# Altium schematic sheet USB_fix.SchDoc
size A3; SheetNumber: 5; SheetTotal: 10
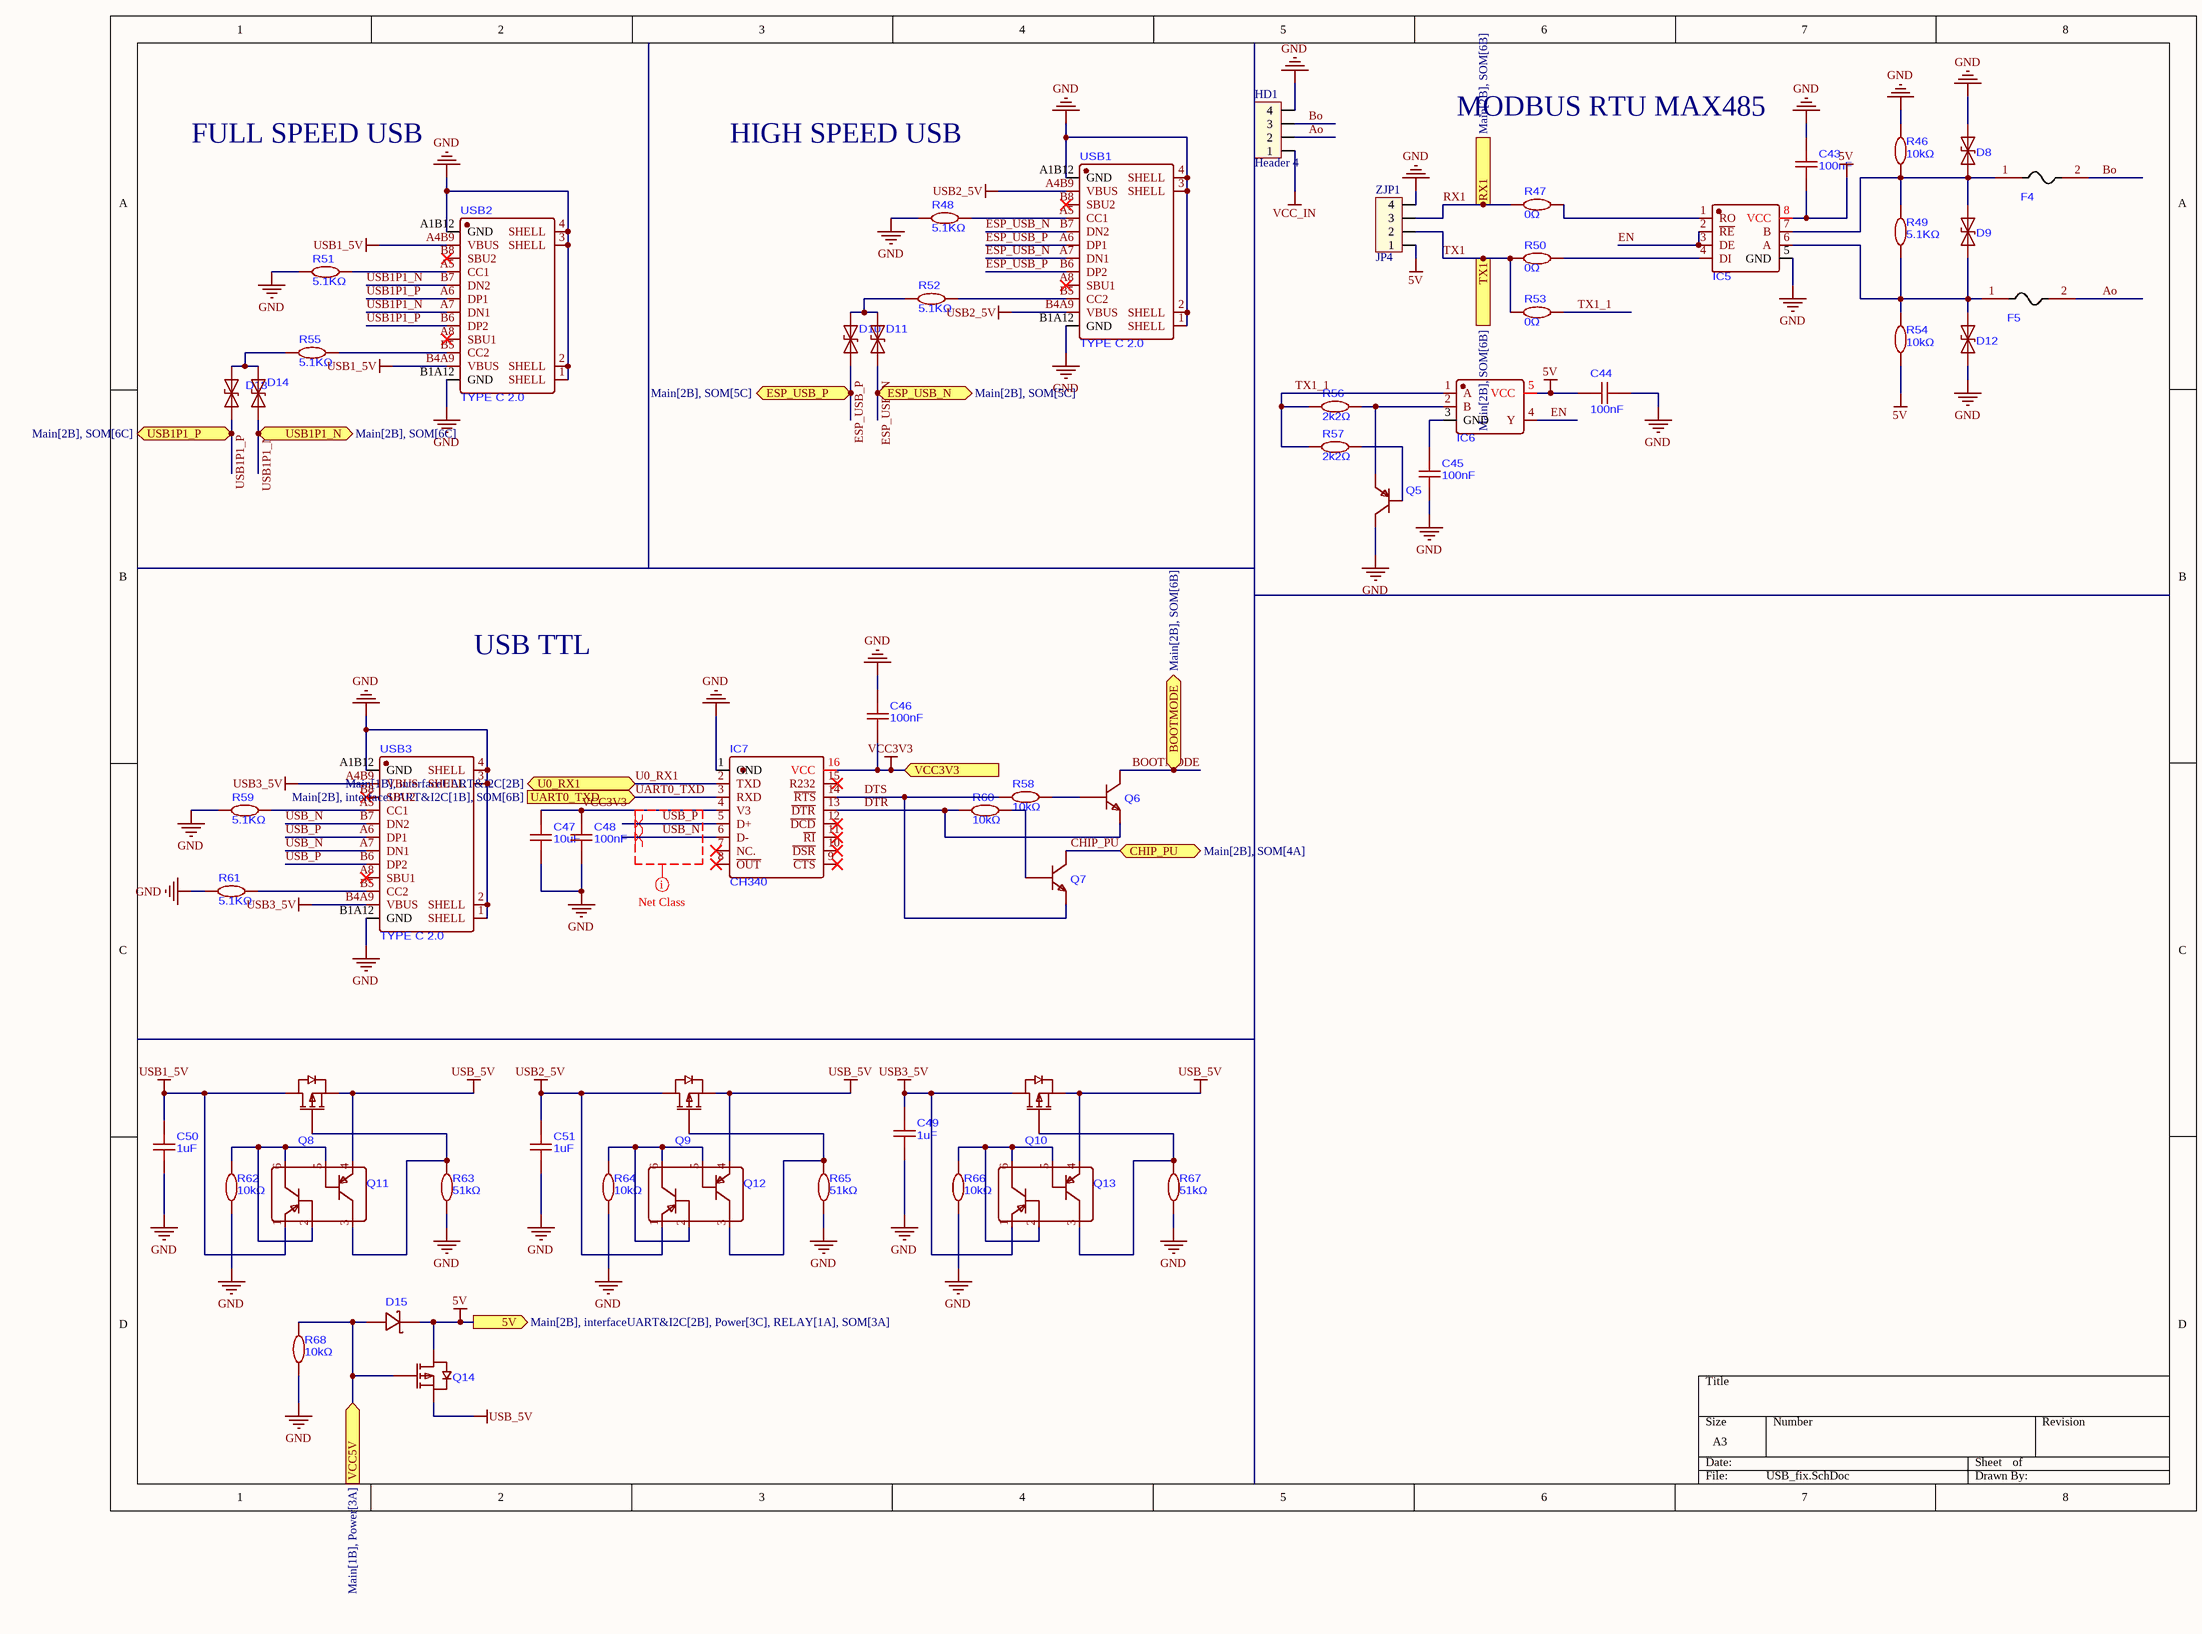
[diagram p0: USB_fix.SchDoc]

## Parts
C43  100nF  [C0603]
C44  100nF  [C0603]
C45  100nF  [C0603]
C46  100nF  [C0603]
C47  10uF  [C0603]
C48  100nF  [C0603]
C49  1uF  [C0603]
C50  1uF  [C0603]
C51  1uF  [C0603]
D8  TVS DIODE 5VWM 18.6VC SOD-523  [SOD-523_L1.2-W0.8-LS1.6-BI]  (value not drawn)
D9  TVS DIODE 5VWM 18.6VC SOD-523  [SOD-523_L1.2-W0.8-LS1.6-BI]  (value not drawn)
D10  TVS DIODE 5VWM 18.6VC SOD-523  [SOD-523_L1.2-W0.8-LS1.6-BI]  (value not drawn)
D11  TVS DIODE 5VWM 18.6VC SOD-523  [SOD-523_L1.2-W0.8-LS1.6-BI]  (value not drawn)
D12  TVS DIODE 5VWM 18.6VC SOD-523  [SOD-523_L1.2-W0.8-LS1.6-BI]  (value not drawn)
D13  TVS DIODE 5VWM 18.6VC SOD-523  [SOD-523_L1.2-W0.8-LS1.6-BI]  (value not drawn)
D14  TVS DIODE 5VWM 18.6VC SOD-523  [SOD-523_L1.2-W0.8-LS1.6-BI]  (value not drawn)
D15  B540CQ-13-F  [SMC_L6.9-W5.9-LS7.9-RD]  (value not drawn)
F4  PTC RESET FUSE 24V 100mA 0603  [F0603]  (value not drawn)
F5  PTC RESET FUSE 24V 100mA 0603  [F0603]  (value not drawn)
HD1  Header 4  [HED4]
IC5  Low-Power, Slew-Rate-Limited RS-485/RS-422 Transceivers  [SOP-8_L4.9-W3.9-P1.27-LS6.0-BL]  (value not drawn)
IC6  SINGLE 2-INPUT NAND GATE WITH SCHMITT-TRIGGER INPUTS  [SOT-23-5_L3.0-W1.7-P0.95-LS2.8-BL]  (value not drawn)
IC7  CH340  [SOP-16_L10.0-W3.9-P1.27-LS6.0-BL]
Q5  TRANS PNP 25V 1.5A SOT-23  [SOT-23-3_L2.9-W1.3-P1.90-LS2.4-BR]  (value not drawn)
Q6  TRANS NPN 25V 0.5A SOT-23  [SOT-23-3_L2.9-W1.3-P1.90-LS2.4-BR]  (value not drawn)
Q7  TRANS NPN 25V 0.5A SOT-23  [SOT-23-3_L2.9-W1.3-P1.90-LS2.4-BR]  (value not drawn)
Q8  MOSFET P-CH 30V 4.3A SOT-23  [SOT-23-3_L2.9-W1.6-P1.90-LS2.8-BR]  (value not drawn)
Q9  MOSFET P-CH 30V 4.3A SOT-23  [SOT-23-3_L2.9-W1.6-P1.90-LS2.8-BR]  (value not drawn)
Q10  MOSFET P-CH 30V 4.3A SOT-23  [SOT-23-3_L2.9-W1.6-P1.90-LS2.8-BR]  (value not drawn)
Q11  TRANS PNP 40V 200mA SOT-363  [SC-70-6_L2.2-W1.3-P0.65-LS2.1-TL]  (value not drawn)
Q12  TRANS PNP 40V 200mA SOT-363  [SC-70-6_L2.2-W1.3-P0.65-LS2.1-TL]  (value not drawn)
Q13  TRANS PNP 40V 200mA SOT-363  [SC-70-6_L2.2-W1.3-P0.65-LS2.1-TL]  (value not drawn)
Q14  MOSFET P-CH 30V 4.3A SOT-23  [SOT-23-3_L2.9-W1.6-P1.90-LS2.8-BR]  (value not drawn)
R46  10kΩ  [R0603]
R47  0Ω  [R0603]
R48  5.1KΩ  [R0603]
R49  5.1KΩ  [R0603]
R50  0Ω  [R0603]
R51  5.1KΩ  [R0603]
R52  5.1KΩ  [R0603]
R53  0Ω  [R0603]
R54  10kΩ  [R0603]
R55  5.1KΩ  [R0603]
R56  2k2Ω  [R0603]
R57  2k2Ω  [R0603]
R58  10kΩ  [R0603]
R59  5.1KΩ  [R0603]
R60  10kΩ  [R0603]
R61  5.1KΩ  [R0603]
R62  10kΩ  [R0603]
R63  51kΩ  [R0603]
R64  10kΩ  [R0603]
R65  51kΩ  [R0603]
R66  10kΩ  [R0603]
R67  51kΩ  [R0603]
R68  10kΩ  [R0603]
USB1  TYPE C 2.0  [USB-C-SMD_G-SWITCH_GT-USB-7010ASV]
USB2  TYPE C 2.0  [USB-C-SMD_G-SWITCH_GT-USB-7010ASV]
USB3  TYPE C 2.0  [USB-C-SMD_G-SWITCH_GT-USB-7010ASV]
ZJP1  JP4  [CON4]

## Ports
5V (out, see Main[2B], interfaceUART&I2C[2B], Power[3C], RELAY[1A], SOM[3A]), BOOTMODE (bidir, see Main[2B], SOM[6B]), CHIP_PU (bidir, see Main[2B], SOM[4A]), ESP_USB_N (bidir, see Main[2B], SOM[5C]), ESP_USB_P (bidir, see Main[2B], SOM[5C]), RX1 (out, see Main[2B], SOM[6B]), TX1 (in, see Main[2B], SOM[6B]), U0_RX1 (bidir, see Main[1B], interfaceUART&I2C[2B]), UART0_TXD (in, see Main[2B], interfaceUART&I2C[1B], SOM[6B]), USB1P1_N (bidir, see Main[2B], SOM[6C]), USB1P1_P (bidir, see Main[2B], SOM[6C]), VCC3V3 (in, see Main[1B], AUDIO CODEC[2C], Power[4C], SENSOR[3A], SOM[4A]), VCC5V (in, see Main[1B], Power[3A])

## Nets
5V: C43.1 C44.2 D15.1(C) IC5.8(VCC) IC6.5(VCC) Q14.3(D) R54.1 ZJP1.1 ; port 5V
GND: C43.2 C44.1 C45.1 C46.2 C47.1 C48.1 C49.1 C50.1 C51.1 D8.2(A) D12.1(K) HD1.4 IC5.5(GND) IC7.1(GND) Q5.3(C) R46.2 R48.1 R51.1 R59.1 R61.1 R62.1 R63.1 R64.1 R65.1 R66.1 R67.1 R68.1 USB1.1(SHELL) USB1.2(SHELL) USB1.3(SHELL) USB1.4(SHELL) USB1.A1B12(GND) USB1.B1A12(GND) USB2.1(SHELL) USB2.2(SHELL) USB2.3(SHELL) USB2.4(SHELL) USB2.A1B12(GND) USB2.B1A12(GND) USB3.1(SHELL) USB3.2(SHELL) USB3.3(SHELL) USB3.4(SHELL) USB3.A1B12(GND) USB3.B1A12(GND) ZJP1.4
USB1_5V: C50.2 Q8.3(D) Q11.1(E2) USB2.A4B9(VBUS) USB2.B4A9(VBUS)
USB2_5V: C51.2 Q9.3(D) Q12.1(E2) USB1.A4B9(VBUS) USB1.B4A9(VBUS)
USB3_5V: C49.2 Q10.3(D) Q13.1(E2) USB3.A4B9(VBUS) USB3.B4A9(VBUS)
USB_5V: Q8.2(S) Q9.2(S) Q10.2(S) Q11.4(E1) Q12.4(E1) Q13.4(E1) Q14.2(S)
VCC3V3: C46.1 C47.2 C48.2 IC7.4(V3) IC7.16(VCC) ; port VCC3V3
VCC_IN: HD1.1
Ao: F5.2 HD1.2
Bo: F4.2 HD1.3
BOOTMODE: Q6.3(C) ; port BOOTMODE
CHIP_PU: Q7.3(C) ; port CHIP_PU
DTR: IC7.13(~{DTR}) Q6.2(E) R60.1
DTS: IC7.14(~{RTS}) Q7.2(E) R58.1
EN: IC5.2(~{RE}) IC5.3(DE) IC6.4(Y)
ESP_USB_N: D11.1(K) USB1.A7(DN1) USB1.B7(DN2) ; port ESP_USB_N
ESP_USB_P: D10.1(K) USB1.A6(DP1) USB1.B6(DP2) ; port ESP_USB_P
RX1: R47.1 ZJP1.3 ; port RX1
TX1: R50.1 R53.1 ZJP1.2 ; port TX1
TX1_1: IC6.1(A) R53.2 R56.2 R57.1
U0_RX1: IC7.2(TXD) ; port U0_RX1
UART0_TXD: IC7.3(RXD) ; port UART0_TXD
USB1P1_N: D14.1(K) USB2.A7(DN1) USB2.B7(DN2) ; port USB1P1_N
USB1P1_P: D13.1(K) USB2.A6(DP1) USB2.B6(DP2) ; port USB1P1_P
USB_N: IC7.6(D-) USB3.A7(DN1) USB3.B7(DN2)
USB_P: IC7.5(D+) USB3.A6(DP1) USB3.B6(DP2)
VCC5V: D15.2(A) Q14.1(G) R68.2 ; port VCC5V
NetC45_2: C45.2 IC6.3(GND)
NetD8_1: D8.1(K) D9.2(A) F4.1 IC5.7(B) R46.1 R49.2
NetD9_1: D9.1(K) D12.2(A) F5.1 IC5.6(A) R49.1 R54.2
NetD10_2: D10.2(A) D11.2(A) R52.1
NetD13_2: D13.2(A) D14.2(A) R55.1
NetIC5_1: IC5.1(RO) R47.2
NetIC5_4: IC5.4(DI) R50.2
NetIC6_2: IC6.2(B) Q5.2(E) R56.1
NetQ5_1: Q5.1(B) R57.2
NetQ6_1: Q6.1(B) R58.2
NetQ7_1: Q7.1(B) R60.2
NetQ8_1: Q8.1(G) Q11.3(C1) R63.2
NetQ9_1: Q9.1(G) Q12.3(C1) R65.2
NetQ10_1: Q10.1(G) Q13.3(C1) R67.2
NetQ11_2: Q11.2(B2) Q11.5(B1) Q11.6(C2) R62.2
NetQ12_2: Q12.2(B2) Q12.5(B1) Q12.6(C2) R64.2
NetQ13_2: Q13.2(B2) Q13.5(B1) Q13.6(C2) R66.2
NetR48_2: R48.2 USB1.A5(CC1)
NetR51_2: R51.2 USB2.A5(CC1)
NetR52_2: R52.2 USB1.B5(CC2)
NetR55_2: R55.2 USB2.B5(CC2)
NetR59_2: R59.2 USB3.A5(CC1)
NetR61_2: R61.2 USB3.B5(CC2)

Not connected (* = marked no-connect by the designer): IC7 7(NC.)* 8(~{OUT})* 9(~{CTS})* 10(~{DSR})* 11(~{RI})* 12(~{DCD})* 15(R232)*; USB1 A8(SBU1)* B8(SBU2)*; USB2 A8(SBU1)* B8(SBU2)*; USB3 A8(SBU1)* B8(SBU2)*

## Layout directives
net class USB: USB_N, USB_P
differential pair; net class DIFF90; differential pair class DIFF90: USB_N, USB_P

## Notes on the sheet
- MODBUS RTU MAX485
- FULL SPEED USB
- HIGH SPEED USB
- USB TTL

## Library data of the parts
C43-C46 C48 = CC0603KRX7R9BB104: 50V 100nF X7R ±10% 0603 Ceramic Capacitors ROHS
C47 = CL10A106MA8NRNC: 25V 10uF X5R ±20% 0603 Ceramic Capacitors ROHS
C49-C51 = CL10B105KA8NNNC: 25V 1uF X7R ±10% 0603 Ceramic Capacitors ROHS
D8-D14 = LESD5D5.0CT1G: 9.4A@8/20us 18.6V 7.8V 5V SOD-523 TVS Diodes RoHS
D15 = B540CQ-13-F: 40V 550mV@5A 5A SMC(DO-214AB) Single Diodes ROHS
F4 F5 = 0603-010-24V: 24V 100mA 40A 300mA 900mΩ 0603 PTC Resettable Fuses RoHS
HD1 = Hed4: Header 4 (Green); Value: Header 4
IC5 = MAX485ESA+T_C41365333: Transceiver 4.75V~5.25V SOIC-8 Drivers, Receivers, Transceivers RoHS
IC6 = TP74LVC1G132S5: 5ns@5V,50pF 10uA 1.65V~5.5V NAND Gate SOT-23-5 Gates and Inverters RoHS
IC7 = CH340C: Transceiver USB 2.0 SOP-16 Interface Controllers RoHS
Q5 = SS8550_C7420371: 300mW 25V 1.5A PNP SOT-23 Single Bipolar Transistors RoHS
Q6 Q7 = S8050_C2828466: 300mW 25V 500mA NPN SOT-23 Single Bipolar Transistors RoHS
Q8-Q10 Q14 = AO3407A: 30V 4.3A 48mΩ@10V 2.5V@250uA 1 P-Channel SOT-23 Single FETs, MOSFETs ROHS
Q11-Q13 = LMBT3906DW1T1: 40V 150mW 200mA PNP SOT-363 Single Bipolar Transistors RoHS
R46 R54 R58 R60 R62 R64 R66 R68 = RC0603FR-0710KL: 100mW 10kΩ 75V ±100ppm/℃ Thick Film Resistor ±1% 0603 Chip Resistor - Surface Mount ROHS
R47 R50 R53 = RC0603JR-070RL: 100mW 0Ω 75V Thick Film Resistor ±5% 0603 Chip Resistor - Surface Mount RoHS
R48 R49 R51 R52 R55 R59 R61 = FRC0603F5101TS: 100mW 5.1kΩ 75V ±100ppm/℃ Thick Film Resistor ±1% 0603 Chip Resistor - Surface Mount RoHS
R56 R57 = RC0603FR-072K2L: 100mW 2.2kΩ 75V ±100ppm/℃ Thick Film Resistor ±1% 0603 Chip Resistor - Surface Mount RoHS
R63 R65 R67 = RC0603FR-07100KL_1RC0603FR-0751KL: 100mW 51kΩ 75V ±100ppm/℃ Thick Film Resistor ±1% 0603 Chip Resistor - Surface Mount RoHS
USB1-USB3 = GT-USB-7010ASV: USB 2.0 1 16P -40℃~+85℃ Type-C SMD USB, DVI, HDMI Connector Assemblies RoHS
ZJP1 = Con4: Connector 4; Value: Connector 4